# EAGLE design T Breadboard 2015 (EAGLE 7.2.0)
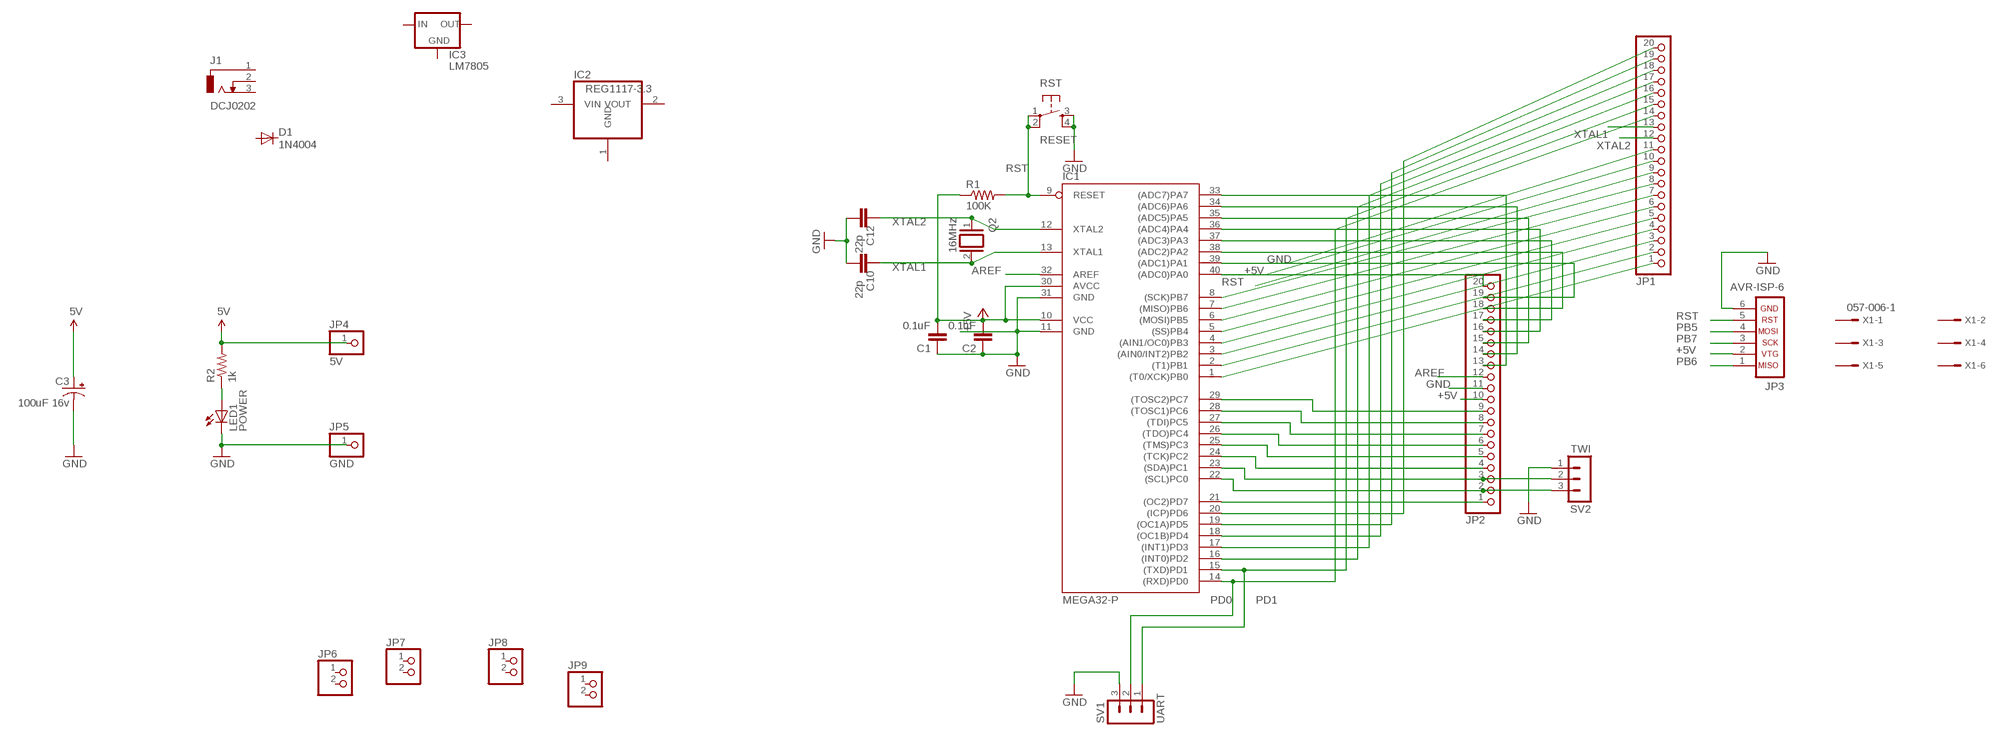
[diagram p0: schematic, sheet 1]

## Parts
C1  0.1uF  CAPPTH2  [CAP-PTH-SMALL2]
C2  0.1uF  CAPPTH2  [CAP-PTH-SMALL2]
C3  100uF 16v  CAP_POLPTH1  [CPOL-RADIAL-100UF-25V]
C10  22p  C-EU025-030X050  [C025-030X050]
C12  22p  C-EU025-030X050  [C025-030X050]
D1  1N4004  [DO41-10]
IC1  MEGA32-P  [DIL40]
IC2  REG1117-3.3  REG1117  [SOT223]
IC3  LM7805  V_REG_78XXSINK  [TO220-IGO]
J1  DCJ0202  [DCJ0202]
JP1  PINHD-1X20  [1X20]
JP2  PINHD-1X20  [1X20]
JP3  AVR-ISP-6  [AVR-ISP-6]
JP4  5V  PINHD-1X1  [1X01]
JP5  GND  PINHD-1X1  [1X01]
JP6  PINHD-1X2  [1X02]
JP7  PINHD-1X2  [1X02]
JP8  PINHD-1X2  [1X02]
JP9  PINHD-1X2  [1X02]
LED1  POWER  LED3MM  [LED3MM]
Q2  16MHz  XTAL/S  [QS]
R1  100K  R-US_0207/10  [0207/10]
R2  1k  RESISTORPTH1  [AXIAL-0.3]
RST  RESET  TAC_SWITCHPTH  [TACTILE-PTH]
SV1  UART  MA03-1  [MA03-1]
SV2  TWI  MA03-1  [MA03-1]
X1  057-006-1  [057-006-1]

## Nets
+5V: C1.2 C2.2 C3.1(+) IC1.10(VCC) IC1.30(AVCC) JP1.10 JP2.10 JP3.2 JP4.1 R1.1 R2.P$2 ; supply symbol labelled 5V
AREF: IC1.32(AREF) JP2.12
GND: C1.1 C2.1 C3.2(-) C10.1 C12.1 IC1.31(GND) JP1.11 JP2.11 JP3.6 JP5.1 LED1.K(C) RST.3 RST.4 SV1.3 SV2.1
LED1: LED1.A R2.P$1
N$1: IC1.1((T0/XCK)PB0) JP1.1
N$2: IC1.20((ICP)PD6) JP1.20
N$3: IC1.2((T1)PB1) JP1.2
N$4: IC1.3((AIN0/INT2)PB2) JP1.3
N$5: IC1.4((AIN1/OC0)PB3) JP1.4
N$6: IC1.5((SS)PB4) JP1.5
N$12: IC1.21((OC2)PD7) JP2.1
N$15: IC1.16((INT0)PD2) JP1.16
N$16: IC1.17((INT1)PD3) JP1.17
N$17: IC1.18((OC1B)PD4) JP1.18
N$18: IC1.19((OC1A)PD5) JP1.19
N$19: IC1.22((SCL)PC0) JP2.2 SV2.3
N$20: IC1.23((SDA)PC1) JP2.3 SV2.2
N$21: IC1.24((TCK)PC2) JP2.4
N$22: IC1.25((TMS)PC3) JP2.5
N$23: IC1.26((TDO)PC4) JP2.6
N$24: IC1.27((TDI)PC5) JP2.7
N$25: IC1.28((TOSC1)PC6) JP2.8
N$26: IC1.29((TOSC2)PC7) JP2.9
N$27: IC1.33((ADC7)PA7) JP2.13
N$28: IC1.34((ADC6)PA6) JP2.14
N$29: IC1.35((ADC5)PA5) JP2.15
N$30: IC1.36((ADC4)PA4) JP2.16
N$31: IC1.37((ADC3)PA3) JP2.17
N$32: IC1.38((ADC2)PA2) JP2.18
N$33: IC1.39((ADC1)PA1) JP2.19
N$34: IC1.40((ADC0)PA0) JP2.20
PB5: IC1.6((MOSI)PB5) JP1.6 JP3.4
PB6: IC1.7((MISO)PB6) JP1.7 JP3.1
PB7: IC1.8((SCK)PB7) JP1.8 JP3.3
PD0: IC1.14((RXD)PD0) JP1.14 SV1.2
PD1: IC1.15((TXD)PD1) JP1.15 SV1.1
RST: IC1.9(RESET) JP1.9 JP3.5 R1.2 RST.1 RST.2
XTAL1: C10.2 IC1.13(XTAL1) JP1.13 Q2.2
XTAL2: C12.2 IC1.12(XTAL2) JP1.12 Q2.1
Unconnected: D1.A D1.C IC2.2(VOUT) IC2.3(VIN) IC3.GND IC3.IN IC3.OUT J1.1 J1.2 J1.3 JP6.1 JP6.2 JP7.1 JP7.2 JP8.1 JP8.2 JP9.1 JP9.2 X1.1 X1.2 X1.3 X1.4 X1.5 X1.6

## Power pins joined to a net without a drawn wire
GND: IC1.11(GND) IC2.1(GND)

## Library data of the parts
C1 C2 = SparkFun:CAP: Capacitor Standard 0603 ceramic capacitor, and 0.1" leaded capacitor.
C3 = SparkFun:CAP_POL: Capacitor Polarized These are standard SMD and PTH capacitors. Normally 10uF, 47uF, and 100uF in electrolytic and tantalum varieties. Always verify the external diameter of the through hole cap, it varies with capacity, voltage, and manufacturer. The EIA devices should be standard.
C10 C12 = SmartPrj:C-EU: CAPACITOR, European symbol
D1 = diode:1N4004: DIODE general purpose rectifier, 1 A
IC1 = atmel:MEGA32-P: MICROCONTROLLER 32 Kbytes FLASH 2 Kbytes SRAM 1 Kbytes EEPROM USART 8-channel 10 bit ADC Source: www.atmel.com .. doc2503.pdf; MPN: ATMEGA32-16PU; OC_FARNELL: 1661729; OC_NEWARK: 51P1794
IC2 = burr-brown:REG1117: 800mA and 1A Low Dropout (LDO) Positive Regulator 1.8V, 2.5V, 2.85V, 3.3V, 5V, and Adj; MPN: REG1117; OC_FARNELL: 1097566; OC_NEWARK: 14P6981
IC3 = SparkFun:V_REG_78XX: Voltage Regulator Standard 7805 5V regulator. IGO (Input Ground Output). Spark Fun Electronics SKU : COM-00107
J1 = con-jack:DCJ0202: DC POWER JACK Source: DCJ0202.pdf; OC_FARNELL: unknown; OC_NEWARK: unknown
JP1 JP2 = pinhead:PINHD-1X20: PIN HEADER
JP3 = atmel:AVR-ISP-6: AVR ISP-6 Serial Programming Header
JP4 JP5 = pinhead:PINHD-1X1: PIN HEADER
JP6-JP9 = pinhead:PINHD-1X2: PIN HEADER
LED1 = SparkFun:LED: LEDs Standard schematic elements and footprints for 5mm, 3mm, 1206, and 0603 sized LEDs. 5mm - Spark Fun Electronics SKU : COM-00529 (and others)
Q2 = special:XTAL/S: CRYSTAL
R1 = resistor:R-US_: RESISTOR, American symbol
R2 = SparkFun:RESISTOR: Resistor Basic schematic elements and footprints for 0603, 1206, and PTH 1/10th watt (small) resistors.
RST = SparkFun:TAC_SWITCH: Momentary Switch Button commonly used for reset or general input. Spark Fun Electronics SKU : COM-00097
SV1 SV2 = con-lstb:MA03-1: PIN HEADER; OC_FARNELL: unknown; OC_NEWARK: unknown
X1 = con-panduit:057-006-: CONNECTOR 6-pin series 057 contact pc board low profile headers; OC_FARNELL: unknown; OC_NEWARK: unknown

## Net classes
0 default: width 0.152 mm, drill 0.305 mm, clearance 0.152 mm

## Board
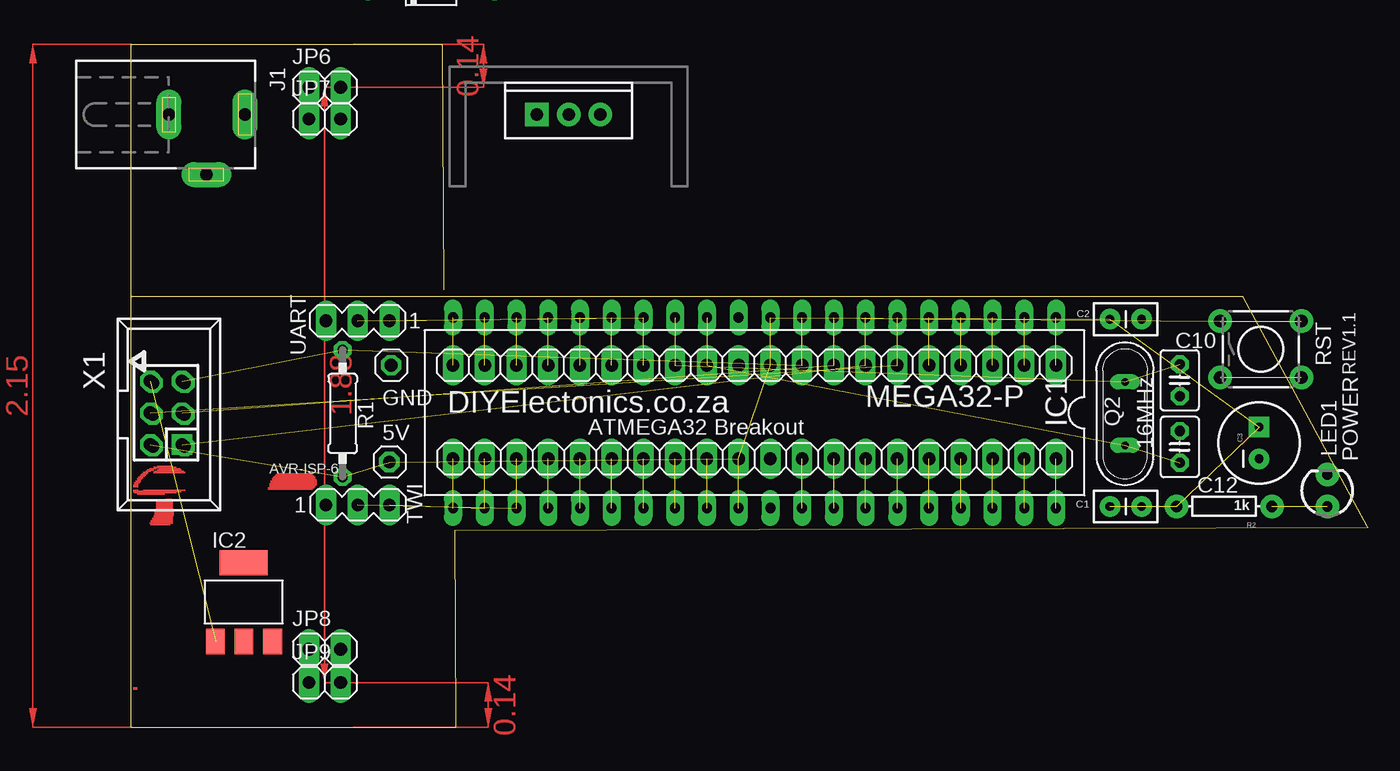
[diagram p1: board, top side]
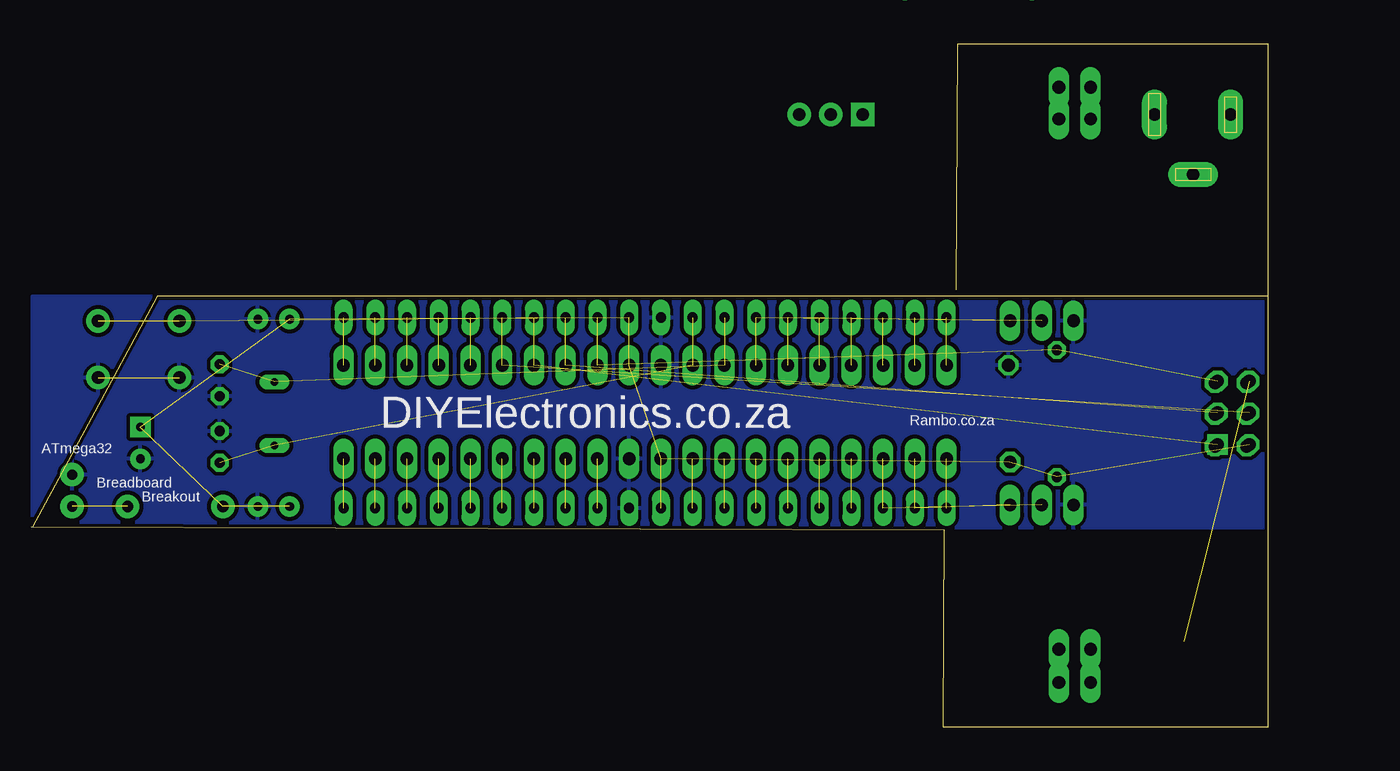
[diagram p2: board, bottom side, seen from below]

Size 99 x 54.61 mm. Coordinates in mm from the lower left corner, seen from the top.
Outline: 0,34.48 0,0 26.02,0 25.91,15.75 99,16
Outline: 0,34.48 88.9,34.48 98.9,16
Outline: 0,34.48 0,54.61 24.89,54.61 25,35
Copper layers (1*16): Top 0.035mm / dielectric 1.5mm / Bottom 0.035mm
Design rules "SparkFun": minimum track width 8mil, minimum drill 20mil, track to track 8mil, track to pad 8mil, pad to pad 8mil, via to via 8mil, smd to smd 8mil, copper to edge 10mil, drill to drill 8mil, minimum pad ring 12mil, minimum via ring 10mil, stop-mask expansion 4mil, vias tented up to drill 25mil, thermal gap 10mil

### Footprints (pad centres in the part's own frame; a part is rotated, then mirrored left to right if it is on the bottom)
CAP-PTH-SMALL2 = drill 0.7 pad 1.651: 1 0,0; 2 2.54,0
CPOL-RADIAL-100UF-25V = drill 0.7 pad 1.651 square: 1 1.27,0 | drill 0.7 pad 1.651: 2 -1.27,0
C025-030X050 = drill 0.813 octagon: 1 -1.27,0; 2 1.27,0
DO41-10 = drill 1.118: A 5.08,0; C -5.08,0
DIL40 = drill 0.813 long: 1 -24.13,-7.62; 2 -21.59,-7.62; 3 -19.05,-7.62; 4 -16.51,-7.62; 5 -13.97,-7.62; 6 -11.43,-7.62; 7 -8.89,-7.62; 8 -6.35,-7.62; 9 -3.81,-7.62; 10 -1.27,-7.62; 11 1.27,-7.62; 12 3.81,-7.62; 13 6.35,-7.62; 14 8.89,-7.62; 15 11.43,-7.62; 16 13.97,-7.62; 17 16.51,-7.62; 18 19.05,-7.62; 19 21.59,-7.62; 20 24.13,-7.62; 21 24.13,7.62; 22 21.59,7.62; 23 19.05,7.62; 24 16.51,7.62; 25 13.97,7.62; 26 11.43,7.62; 27 8.89,7.62; 28 6.35,7.62; 29 3.81,7.62; 30 1.27,7.62; 31 -1.27,7.62; 32 -3.81,7.62; 33 -6.35,7.62; 34 -8.89,7.62; 35 -11.43,7.62; 36 -13.97,7.62; 37 -16.51,7.62; 38 -19.05,7.62; 39 -21.59,7.62; 40 -24.13,7.62
SOT223 = smd 1.499 x 2.007: 1 -2.261,-3.15; 2 0.025,-3.15; 3 2.311,-3.15 | smd 3.81 x 2.007: 4 0,3.15
TO220-IGO = drill 1 pad 1.88: GND 0,0; OUT 2.54,0 | drill 1 pad 1.88 square: IN -2.54,0
DCJ0202 = drill 1 pad 2 long: 1 0,3.1; 2 4.8,0; 3 0,-3
1X20 = drill 1.016 long: 1 -24.13,0; 2 -21.59,0; 3 -19.05,0; 4 -16.51,0; 5 -13.97,0; 6 -11.43,0; 7 -8.89,0; 8 -6.35,0; 9 -3.81,0; 10 -1.27,0; 11 1.27,0; 12 3.81,0; 13 6.35,0; 14 8.89,0; 15 11.43,0; 16 13.97,0; 17 16.51,0; 18 19.05,0; 19 21.59,0; 20 24.13,0
AVR-ISP-6 = drill 1.016 square: 1 -2.54,-1.27 | drill 1.016 octagon: 2 -2.54,1.27; 3 0,-1.27; 4 0,1.27; 5 2.54,-1.27; 6 2.54,1.27
1X01 = drill 1.016 octagon: 1 0,0
1X02 = drill 1.016 long: 1 -1.27,0; 2 1.27,0
LED3MM = drill 0.813 pad 1.88: A -1.27,0; K 1.27,0
QS = drill 0.61 long: 1 -2.54,0; 2 2.54,0
0207/10 = drill 0.813 octagon: 1 -5.08,0; 2 5.08,0
AXIAL-0.3 = drill 0.9 pad 1.88: P$1 -3.81,0; P$2 3.81,0
TACTILE-PTH = drill 1.016 pad 1.88: 1 -3.251,2.261; 2 3.251,2.261; 3 -3.251,-2.261; 4 3.251,-2.261
MA03-1 = drill 1.016 long: 1 -2.54,0; 2 0,0; 3 2.54,0
057-006-1 = drill 1 octagon: 1 -2.54,-1.27; 2 -2.54,1.27; 3 0,-1.27; 4 0,1.27; 5 2.54,-1.27; 6 2.54,1.27

### Placement (x,y rotation side)
C1  80.87,17.65 180 top
C2  80.87,32.64 180 top
C3  90.26,22.73 90 top
C10  83.91,27.75 90 top
C12  83.91,22.41 270 top
D1  24,59 0 top  (outside the outline)
IC1  49.88,25.14 180 top
IC2  9,10 0 top
IC3  35,49 0 top
J1  6,49 270 top
JP1  49.88,28.95 180 top
JP2  49.88,21.46 0 top
JP3  2.79,25.14 90 top
JP4  20.67,21.21 0 top
JP5  20.8,28.95 0 top
JP6  15.49,51.18 0 top
JP7  15.49,48.64 0 top
JP8  15.49,6.22 0 top
JP9  15.49,3.56 0 top
LED1  95.72,18.92 90 top
Q2  79.53,25.08 90 top
R1  16.92,25.09 90 top
R2  87.47,17.65 180 top
RST  90.39,30.22 0 top
SV1  18.13,32.51 180 top
SV2  18.13,17.78 0 top
X1  3,25 270 top

### Tracks (layer width: path | path; a pad name or v marks a point on that pad's centre or on a via)
+5V  (10 unrouted)
AREF  (1 unrouted)
GND  (2 unrouted)
  pour Bottom (isolate 0.305): 0,16 0,34.67 98.9,34.44 98.9,16
LED1  (1 unrouted)
N$1  (1 unrouted)
N$2  (1 unrouted)
N$3  (1 unrouted)
N$4  (1 unrouted)
N$5  (1 unrouted)
N$6  (1 unrouted)
N$12  (1 unrouted)
N$15  (1 unrouted)
N$16  (1 unrouted)
N$17  (1 unrouted)
N$18  (1 unrouted)
N$19  (2 unrouted)
N$20  (2 unrouted)
N$21  (1 unrouted)
N$22  (1 unrouted)
N$23  (1 unrouted)
N$24  (1 unrouted)
N$25  (1 unrouted)
N$26  (1 unrouted)
N$27  (1 unrouted)
N$28  (1 unrouted)
N$29  (1 unrouted)
N$30  (1 unrouted)
N$31  (1 unrouted)
N$32  (1 unrouted)
N$33  (1 unrouted)
N$34  (1 unrouted)
PB5  (2 unrouted)
PB6  (2 unrouted)
PB7  (2 unrouted)
PD0  (2 unrouted)
PD1  (2 unrouted)
RST  (5 unrouted)
XTAL1  (3 unrouted)
XTAL2  (3 unrouted)
(copper drawn outside any net)
  shapes: Top area x66

### Text on the board
tPlace: REV1.1 | DIYElectonics.co.za | ATMEGA32 Breakout
bPlace: Rambo.co.za | DIYElectronics.co.za | ATmega32 | Breadboard | Breakout